# EAGLE schematic CLONE_EEPROM_95040_GMC_2A (EAGLE 9.6.2)
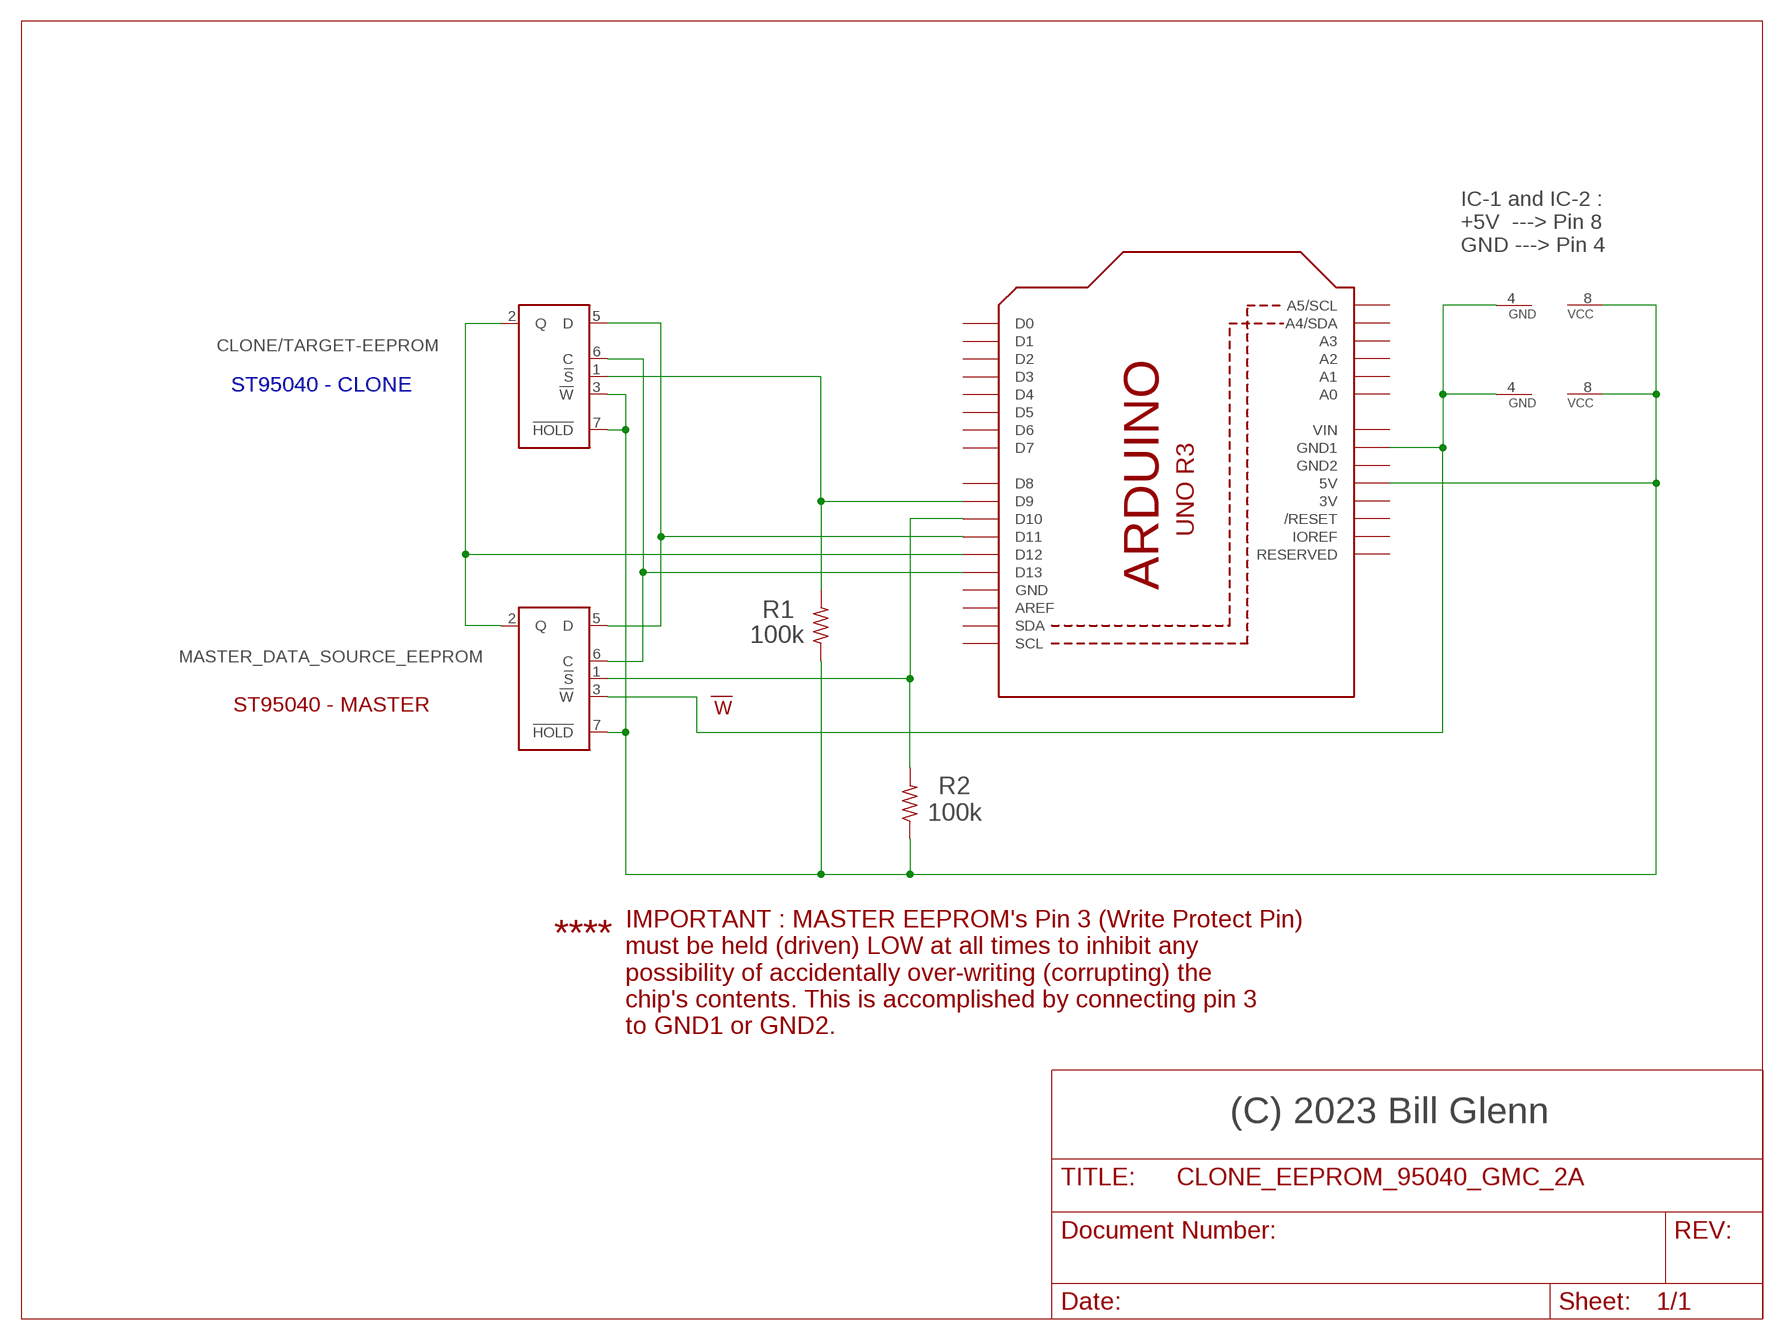
[diagram p0: schematic, sheet 1]

## Parts
CLONE/TARGET-EEPROM  ST95040 - CLONE  ST95P08B  [DIL-08]
MASTER_DATA_SOURCE_EEPROM  ST95040 - MASTER  ST95P08B  [DIL-08]
R1  100k  R-US_0207/15  [0207/15]
R2  100k  R-US_0207/15  [0207/15]
U1  ARDUINOR3-BPLACE  [ARDUINOR3-BPLACE]

## Nets
N$1: CLONE/TARGET-EEPROM.1(!S) R1.2 U1.D9
N$2: CLONE/TARGET-EEPROM.6(C) MASTER_DATA_SOURCE_EEPROM.6(C) U1.D13
N$3: CLONE/TARGET-EEPROM.5(D) MASTER_DATA_SOURCE_EEPROM.5(D) U1.D11
N$4: MASTER_DATA_SOURCE_EEPROM.1(!S) R2.2 U1.D10
N$5: CLONE/TARGET-EEPROM.2(Q) MASTER_DATA_SOURCE_EEPROM.2(Q) U1.D12
N$7: CLONE/TARGET-EEPROM.4(GND) MASTER_DATA_SOURCE_EEPROM.3(!W) MASTER_DATA_SOURCE_EEPROM.4(GND) U1.GND1
N$9: CLONE/TARGET-EEPROM.3(!W) CLONE/TARGET-EEPROM.7(!HOLD) CLONE/TARGET-EEPROM.8(VCC) MASTER_DATA_SOURCE_EEPROM.7(!HOLD) MASTER_DATA_SOURCE_EEPROM.8(VCC) R1.1 R2.1 U1.5V
Unconnected: U1.A0 U1.A1 U1.A2 U1.A3 U1.A4(A4/SDA) U1.A5(A5/SCL) U1.AREF U1.D0 U1.D1 U1.D2 U1.D3 U1.D4 U1.D5 U1.D6 U1.D7 U1.D8 U1.IOREF U1.RESERVED U1.RESET(/RESET) U1.SCL U1.SDA

## Notes on the sheet
- IC-1 and IC-2 :
  +5V  ---> Pin 8
  GND ---> Pin 4
- __
- W
- ****
- IMPORTANT : MASTER EEPROM's Pin 3 (Write Protect Pin)
  must be held (driven) LOW at all times to inhibit any
  possibility of accidentally over-writing (corrupting) the
  chip's contents. This is accomplished by connecting pin 3
  to GND1 or GND2.
- (C) 2023 Bill Glenn

## Power pins joined to a net without a drawn wire
3V: U1.3V
GND: U1.GND
GND2: U1.GND2
VIN: U1.VIN

## Library data of the parts
CLONE/TARGET-EEPROM MASTER_DATA_SOURCE_EEPROM = st-microelectronics:ST95P08B: Serial EEPROM SPI bus, 1 K x 8; OC_FARNELL: unknown; OC_NEWARK: unknown
R1 R2 = adafruit:R-US_: RESISTOR, American symbol
U1 = adafruit:ARDUINOR3: This is a new object for the new Arduino R3 - with extra pins that you may want to use (such as IOref, and duplicated A4/A5